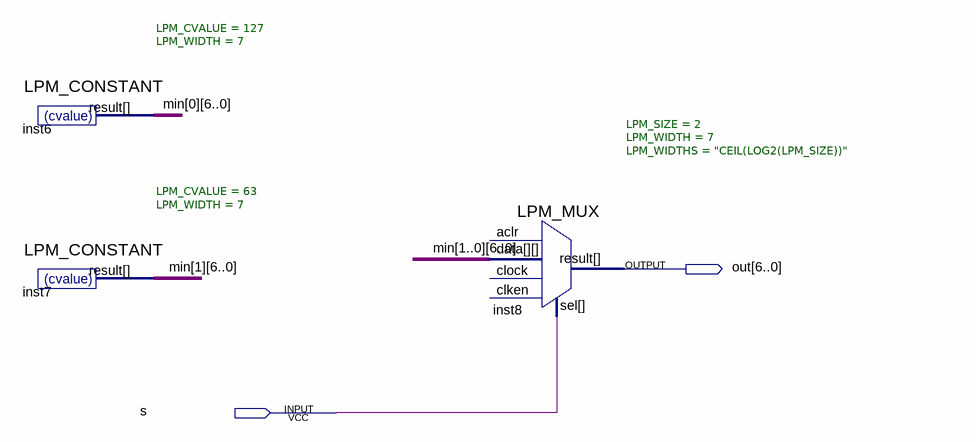
[diagram p0: schematic sheet]
// Quartus schematic ULA_display_sig.bdf as structural Verilog: 3 symbols, 2 pins
module ULA_display_sig (
  input  s,
  output [6:0] out
);

  wire [6:0] min_0, min_1;

  LPM_CONSTANT #(.LPM_CVALUE(127), .LPM_WIDTH(7)) inst6 (.result(min_0));
  LPM_CONSTANT #(.LPM_CVALUE(63), .LPM_WIDTH(7)) inst7 (.result(min_1));
  LPM_MUX #(.LPM_SIZE(2), .LPM_WIDTH(7), .LPM_WIDTHS("CEIL(LOG2(LPM_SIZE))")) inst8 (
    .data({min_1, min_0}), .sel(s), .result(out));  // open: clock, aclr, clken
endmodule
